# EAGLE schematic WiFiLed (EAGLE 9.6.2)
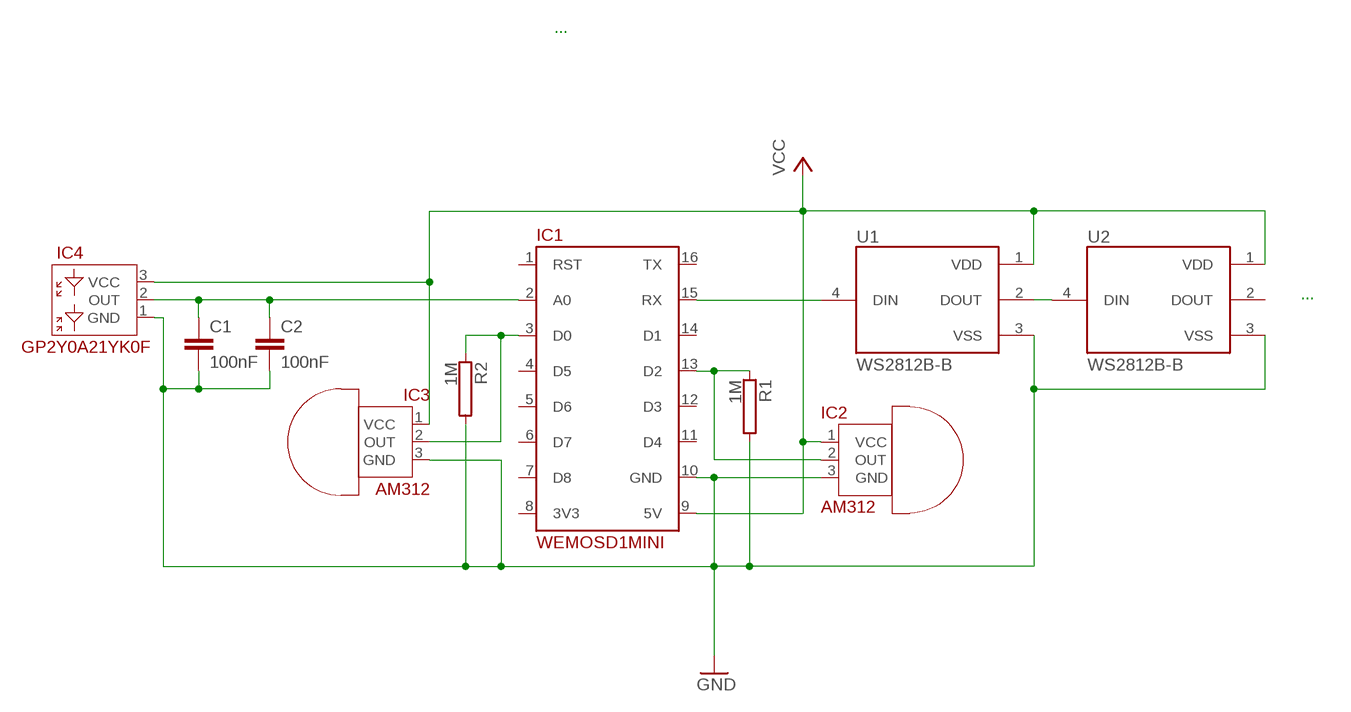
[diagram p0: schematic, sheet 1]

## Parts
C1  100nF  C2,5-3  [C2.5-3]
C2  100nF  C2,5-3  [C2.5-3]
IC1  WEMOSD1MINI  [ESP32_DIL16]
IC2  AM312  [AM312]
IC3  AM312  [AM312]
IC4  GP2Y0A21YK0F  [GP2Y0A21YK0F]
R1  1M  RAC01  [AC01]
R2  1M  RAC01  [AC01]
U1  WS2812B-B  [LED_WS2812B-B]
U2  WS2812B-B  [LED_WS2812B-B]

## Nets
GND: C1.2 C2.2 IC1.10(GND) IC2.3(GND) IC3.3(GND) IC4.1(GND) R1.2 R2.2 U1.3(VSS) U2.3(VSS)
N$1: IC1.15(RX) U1.4(DIN)
N$2: U1.2(DOUT) U2.4(DIN)
N$3: C1.1 C2.1 IC1.2(A0) IC4.2(OUT)
N$6: IC1.13(D2) IC2.2(OUT) R1.1
N$8: IC1.3(D0) IC3.2(OUT) R2.1
VCC: IC1.9(5V) IC2.1(VCC) IC3.1(VCC) IC4.3(VCC) U1.1(VDD) U2.1(VDD)
Unconnected: IC1.1(RST) IC1.4(D5) IC1.5(D6) IC1.6(D7) IC1.7(D8) IC1.8(3V3) IC1.11(D4) IC1.12(D3) IC1.14(D1) IC1.16(TX) U2.2(DOUT)

## Notes on the sheet
- ...
- ...

## Library data of the parts
C1 C2 = capacitor-wima:C: CAPACITOR naming: grid - package width
IC1 = WemosD1mini:WEMOSD1MINI
IC2 IC3 = AM312:AM312
IC4 = GP2Y0A21YK0F:GP2Y0A21YK0F
R1 R2 = resistor-power:R: Power Resitor; OC_FARNELL: unknown; OC_NEWARK: unknown
U1 U2 = WS2812B-B:WS2812B-B: Intelligent control LED integrated light source Check availability <https://pricing.snapeda.com/parts/WS2812B-B/Worldsemi/view-part?ref=eda>; AVAILABILITY: Not in stock; DESCRIPTION: Intelligent control LED integrated light source; MF: Worldsemi; MP: WS2812B-B; PACKAGE: Package; PRICE: None